# Altium schematic sheet Sheet1_Hackathon.SchDoc
size 209 x 297 mm; SheetNumber: 1; SheetTotal: 2
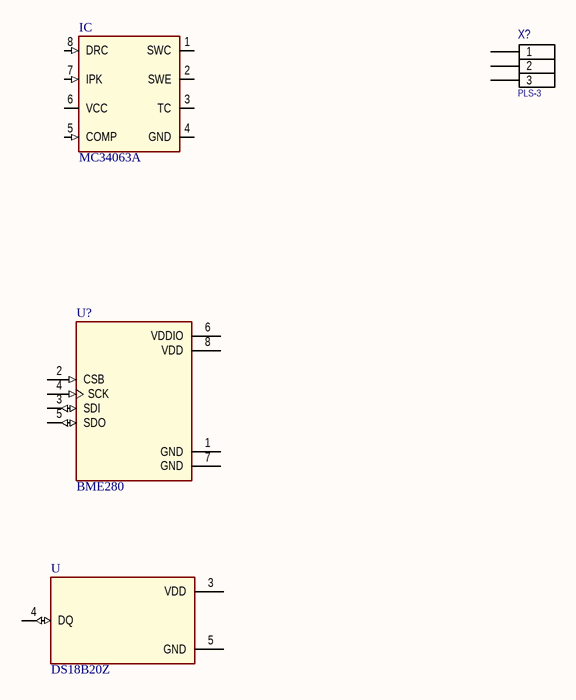
[diagram p0: Sheet1_Hackathon.SchDoc]

## Parts
IC  MC34063A  [SO08]
U  DS18B20Z  [SOIC127P600X175-8N]
U?  BME280  [PSON65P250X250X100-8N]
X?  PLS-3  [PLS-3-3D]

## Nets

Not connected (* = marked no-connect by the designer): IC 1(SWC) 2(SWE) 3(TC) 4(GND) 5(COMP) 6(VCC) 7(IPK) 8(DRC); U 3(VDD) 4(DQ) 5(GND); U? 1(GND) 2(CSB) 3(SDI) 4(SCK) 5(SDO) 6(VDDIO) 7(GND) 8(VDD); X? 1 2 3

## Library data of the parts
IC = MC34063A: Buck, Boost Switching Regulator IC Positive or Negative Adjustable 1.25V 1 Output 1.5A _Switch_ 8-SOIC _0.154, 3.90mm Width_; MF: Texas Instruments; Package: SOIC-8 Texas Instruments; MP: MC34063A; Availability: Unavailable; Price: None; Value: *; SnapEDA_Link: https://www.snapeda.com/parts/MC34063A/Texas%20Instruments/view-part/581314/?ref=snap
U = DS18B20Z: Temperature Sensor Digital, Local -55Â°C ~ 125Â°C 12 b 8-SOIC; MP: DS18B20Z+; MF: Maxim Integrated; Availability: Unavailable; SnapEDA_Link: https://www.snapeda.com/parts/DS18B20Z%2B/Maxim%20Integrated/view-part/109391/?ref=snap; Value: *; Package: SOIC-8 Maxim; Price: None
U? = BME280: DIGITAL HUMIDITY, PRESSURE AND TEMPERATURE SENSOR<br>* Digital interface IÂ²C (up to 3.4 MHz) and SPI (3 and 4 wire, up to 10 MHz)* Supply voltage VDD main supply voltage range: 1.71 V to 3.6 V*VDDIO interface voltage range: 1.2 V to 3.6 V<br> Operating range -40â€¦+85 Â°C, 0â€¦100 % rel. humidity, 300â€¦1100 hPa <br><br>  The library has been designed by<a href="https://www.facebook.com/groups/eaglecadsoftUK"> Richard Magdycz</a>; Package: None; Availability: Unavailable; MP: BME280; Value: *; Price: None
X? = PLS-3: Header, 3-Pin; LatestRevisionDate: 17-Jul-2002; LatestRevisionNote: Re-released for DXP Platform.; Publisher: Altium Limited